# Altium project PCB_Project1.PrjPCB
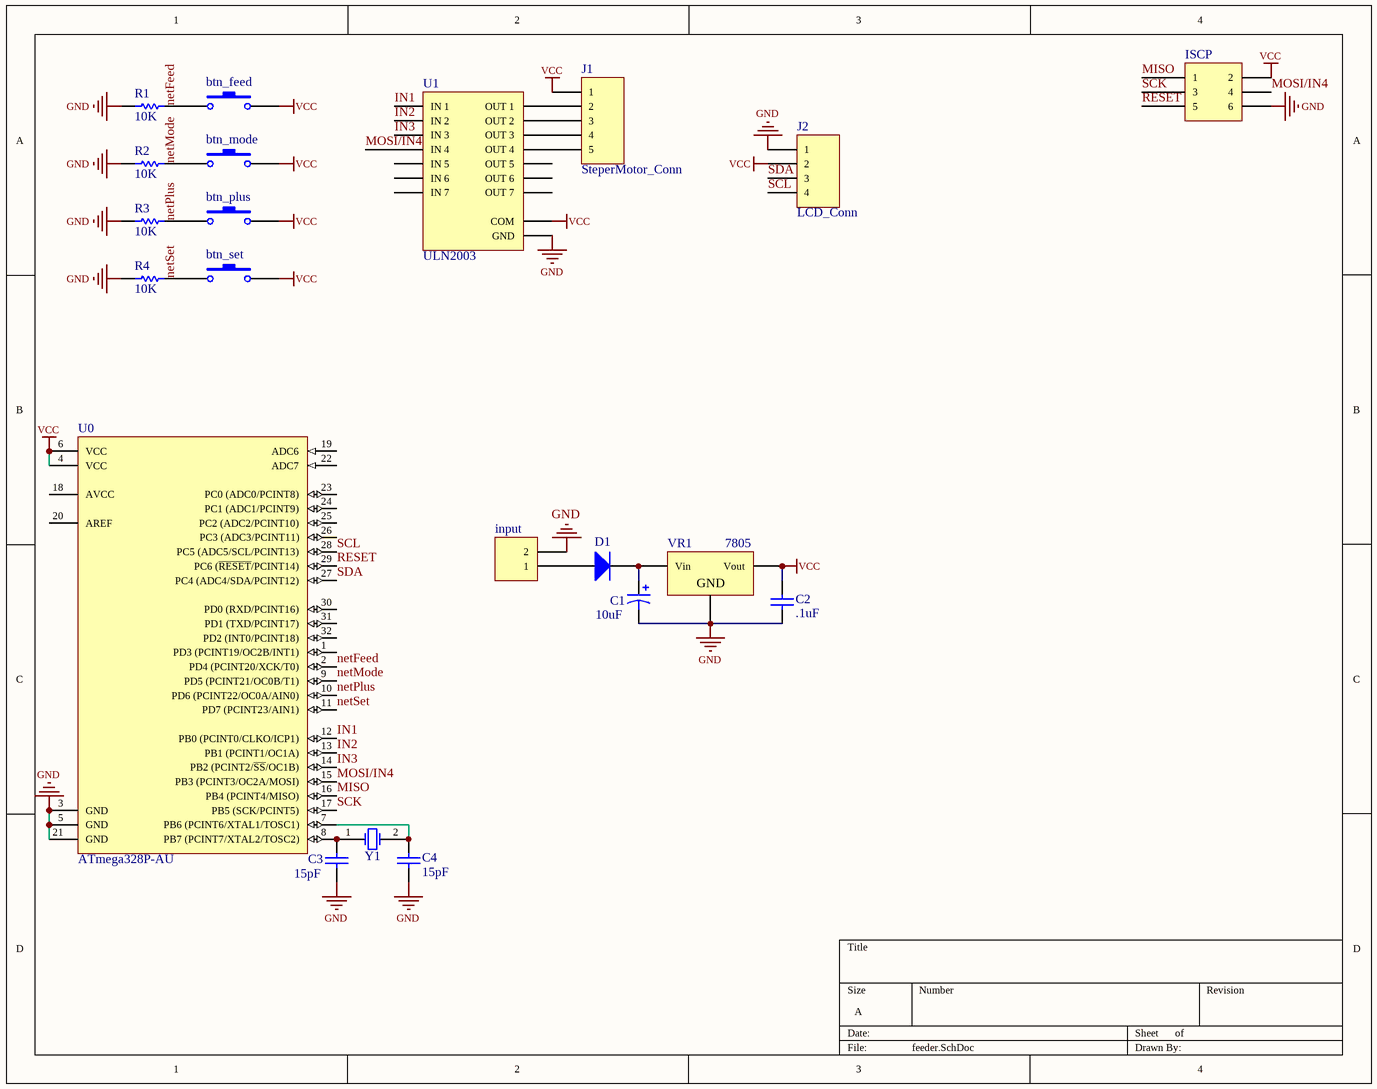
[diagram p0: feeder.SchDoc]
1 sheet, 21 parts. Net scope: global (net labels, ports and power ports of the same name join across sheets).
Board file: FEEDER.PcbDoc

## Sheet feeder.SchDoc
size A

### Parts
btn_feed  SW-PB  [BUTTON]  (value not drawn)
btn_mode  SW-PB  [BUTTON]  (value not drawn)
btn_plus  SW-PB  [BUTTON]  (value not drawn)
btn_set  SW-PB  [BUTTON]  (value not drawn)
C1  value 10uF  [C100_round]  (hidden comment: Cap Pol1)
C2  value .1uF  [C100_round]  (hidden comment: Cap)
C3  value 15pF  [Cap1206_throu]  (hidden comment: Cap)
C4  value 15pF  [Cap1206_throu]  (hidden comment: Cap)
D1  Diode  [Diode_smd_throug]  (value not drawn)
input  POWER IN  [C_120x100]  (value not drawn)
ISCP  Header 3X2  [ISP_6pin_2]  (value not drawn)
J1  SteperMotor_Conn  [HDR1X5]
J2  LCD_Conn  [HDR1X4]
R1  value 10K  [Cap1206_new]  (hidden comment: Res1)
R2  value 10K  [Cap1206_new]  (hidden comment: Res1)
R3  value 10K  [Cap1206_new]  (hidden comment: Res1)
R4  value 10K  [Cap1206_new]  (hidden comment: Res1)
U0  ATmega328P-AU  [TQFP_32_Atmega8a]
U1  ULN2003  [SOIC16]
VR1  7805  [SOT-223B]
Y1  XTAL  [XTAL-2]  (value not drawn)

### Nets
GND: C1.2 C2.2 C3.1 C4.1 input.2 ISCP.6 J2.1 R1.2 R2.2 R3.2 R4.2 U0.3(GND) U0.5(GND) U0.21(GND) U1.8(GND) VR1.2(GND)
VCC: btn_feed.2 btn_mode.2 btn_plus.2 btn_set.2 C2.1 ISCP.2 J1.1 J2.2 U0.4(VCC) U0.6(VCC) U1.9(COM) VR1.3(Vout)
IN1: U0.12(PB0_(PCINT0/CLKO/ICP1)) U1.1(IN_1)
IN2: U0.13(PB1_(PCINT1/OC1A)) U1.2(IN_2)
IN3: U0.14(PB2_(PCINT2/~{SS}/OC1B)) U1.3(IN_3)
MISO: ISCP.1 U0.16(PB4_(PCINT4/MISO))
MOSI/IN4: ISCP.4 U0.15(PB3_(PCINT3/OC2A/MOSI)) U1.4(IN_4)
netFeed: btn_feed.1 R1.1 U0.2(PD4_(PCINT20/XCK/T0))
netMode: btn_mode.1 R2.1 U0.9(PD5_(PCINT21/OC0B/T1))
netPlus: btn_plus.1 R3.1 U0.10(PD6_(PCINT22/OC0A/AIN0))
netSet: btn_set.1 R4.1 U0.11(PD7_(PCINT23/AIN1))
RESET: ISCP.5 U0.29(PC6_(~{RESET}/PCINT14))
SCK: ISCP.3 U0.17(PB5_(SCK/PCINT5))
SCL: J2.4 U0.28(PC5_(ADC5/SCL/PCINT13))
SDA: J2.3 U0.27(PC4_(ADC4/SDA/PCINT12))
NetC1_1: C1.1 D1.2(K) VR1.1(Vin)
NetC3_2: C3.2 U0.8(PB7_(PCINT7/XTAL2/TOSC2)) Y1.1(OSC1)
NetC4_2: C4.2 U0.7(PB6_(PCINT6/XTAL1/TOSC1)) Y1.2(OSC2)
NetD1_1: D1.1(A) input.1
NetJ1_2: J1.2 U1.16(OUT_1)
NetJ1_3: J1.3 U1.15(OUT_2)
NetJ1_4: J1.4 U1.14(OUT_3)
NetJ1_5: J1.5 U1.13(OUT_4)

Not connected (* = marked no-connect by the designer): U0 1(PD3_(PCINT19/OC2B/INT1)) 18(AVCC) 19(ADC6) 20(AREF) 22(ADC7) 23(PC0_(ADC0/PCINT8)) 24(PC1_(ADC1/PCINT9)) 25(PC2_(ADC2/PCINT10)) 26(PC3_(ADC3/PCINT11)) 30(PD0_(RXD/PCINT16)) 31(PD1_(TXD/PCINT17)) 32(PD2_(INT0/PCINT18)); U1 5(IN_5) 6(IN_6) 7(IN_7) 10(OUT_7) 11(OUT_6) 12(OUT_5)

### Library data of the parts
btn_feed btn_mode btn_plus btn_set = SW-PB: Switch; Published: 24-Mar-1999; LatestRevisionDate: 17-Jul-2002; LatestRevisionNote: Re-released for DXP Platform.; PackageReference: SPST-2; Publisher: Altium Limited; PackageDescription: Switch; 2 Leads
C1 = Cap Pol1: Polarized Capacitor (Radial); Published: 8-Jun-2000; LatestRevisionDate: 17-Jul-2002; LatestRevisionNote: Re-released for DXP Platform.; PackageReference: RB7.6-15; Publisher: Altium Limited; PackageDescription: Polarized Capacitor (Radial); 2 Leads
C2-C4 = Cap: Capacitor; Published: 8-Jun-2000; LatestRevisionDate: 17-Jul-2002; LatestRevisionNote: Re-released for DXP Platform.; PackageReference: RAD-0.3; Publisher: Altium Limited; PackageDescription: Radial Cap, Thru-Hole; 2 Leads; 0.3 in Pin Spacing
D1 = Diode: Default Diode; Published: 8-Jun-2000; LatestRevisionDate: 17-Jul-2002; LatestRevisionNote: Re-released for DXP Platform.; PackageVersion: Sep-1996; PackageReference: SMC; Publisher: Altium Limited; PackageDescription: DO-214-AB/SMC; 2 C-Bend Leads; Body 7.9 x 5.9 mm, inc. leads (LxW); Code_JEDEC: DO-214-AB
input = Header 2: Header, 2-Pin; LatestRevisionDate: 17-Jul-2002; LatestRevisionNote: Re-released for DXP Platform.; Publisher: Altium Limited
ISCP = Header 3X2: Header, 3-Pin, Dual row; LatestRevisionDate: 17-Jul-2002; LatestRevisionNote: Re-released for DXP Platform.; Publisher: Altium Limited
J1 = Header 5: Header, 5-Pin; LatestRevisionDate: 17-Jul-2002; LatestRevisionNote: Re-released for DXP Platform.; Publisher: Altium Limited
J2 = Header 4: Header, 4-Pin; LatestRevisionDate: 17-Jul-2002; LatestRevisionNote: Re-released for DXP Platform.; Publisher: Altium Limited
R1-R4 = Res1: Resistor; Published: 8-Jun-2000; LatestRevisionDate: 17-Jul-2002; LatestRevisionNote: Re-released for DXP Platform.; PackageReference: AXIAL-0.3; Publisher: Altium Limited; PackageDescription: Axial Device, Thru-Hole; 2 Leads; 0.3 in Pin Spacing
U0 = ATmega328P-AU: 8-bit AVR Microcontroller, 32KB Flash, 1KB EEPROM, 2KB SRAM, 32-pin TQFP, Industrial Grade (-40°C to 85°C); Published: 1-Apr-2010; DatasheetVersion: revA, Jan-2010; PackageVersion: revB, Oct-2001; PackageReference: 32A; Publisher: Altium Limited; PackageDescription: 32-Lead, 7x7x1.0 mm Body, 0.8mm Lead Pitch, Thin Profile Plastic Quad Flat Package (TQFP); Supplier 1: Digi-Key; Supplier Part Number 1: ATMEGA328P-AU-ND; Supplier 2: Farnell; Supplier Part Number 2: 1715486; Supplier 3: Mouser; Supplier Part Number 3: 556-ATMEGA328P-AU; Code_JEDEC: MS-026-ABA; ComponentLink1Description: Manufacturer Link; ComponentLink1URL: http://www.atmel.com/products/avr/default.asp?; ComponentLink2Description: ATmega48A/48PA/88A/88PA/168A/168PA/328/328P Datasheet; ComponentLink2URL: http://www.atmel.com/dyn/resources/prod_documents/8271.pdf; ComponentLink3Description: ATmega48A/48PA/88A/88PA/168A/168PA/328/328P Summary; ComponentLink3URL: http://www.atmel.com/dyn/resources/prod_documents/8271S.pdf; ComponentLink4Description: Atmel.com Home; ComponentLink4URL: http://www.atmel.com
VR1 = Volt Reg: Voltage Regulator; Published: 24-Mar-1999; LatestRevisionDate: 29-May-2009; LatestRevisionNote: IPC-7351 Footprint Added.; PackageReference: D2PAK; Publisher: Altium Limited; PackageDescription: 3-Pin Transistor Outline Package 2.54 mm Pitch, 15.1 mm Lead Span
Y1 = XTAL: Crystal Oscillator; Published: 8-Jun-2000; LatestRevisionDate: 17-Jul-2002; LatestRevisionNote: Re-released for DXP Platform.; PackageReference: R38; Publisher: Altium Limited; PackageDescription: Crystal, Thru-Hole; 2 Leads; Body 3.1 x 8.2 mm (Dia.xH)